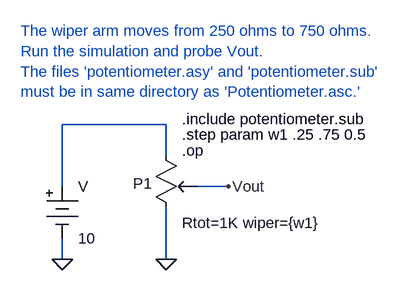
[diagram p0: schematic Potentiometer.asc]
Potentiometer.asc, the LTspice schematic file:
Version 4
SHEET 1 2024 848
WIRE -432 -560 -592 -560
WIRE -432 -512 -432 -560
WIRE -592 -464 -592 -560
WIRE -336 -464 -384 -464
WIRE -592 -352 -592 -384
WIRE -432 -352 -432 -432
FLAG -432 -352 0
FLAG -592 -352 0
FLAG -336 -464 Vout
SYMBOL Misc\\battery -592 -480 R0
WINDOW 123 0 0 Left 0
WINDOW 39 0 0 Left 0
SYMATTR InstName V
SYMATTR Value 10
SYMBOL potentiometer -448 -528 R0
WINDOW 3 40 120 Left 0
WINDOW 0 -35 59 Left 0
SYMATTR Value Rtot=1K wiper={w1}
SYMATTR InstName P1
TEXT -408 -568 Left 0 !.include potentiometer.sub
TEXT -408 -544 Left 0 !.step param w1 .25 .75 0.5
TEXT -408 -520 Left 0 !.op
TEXT -656 -704 Left 0 ;The wiper arm moves from 250 ohms to 750 ohms.\nRun the simulation and probe Vout.\nThe files 'potentiometer.asy' and 'potentiometer.sub'\nmust be in same directory as 'Potentiometer.asc.'

The netlist it stands for:
* Potentiometer.asc
V N001 0 10
XP1 N001 0 Vout potentiometer Rtot=1K wiper={w1}  ; pins A B C
.include potentiometer.sub
.step param w1 .25 .75 0.5
.op
* The wiper arm moves from 250 ohms to 750 ohms.
* Run the simulation and probe Vout.
* The files 'potentiometer.asy' and 'potentiometer.sub'
* must be in same directory as 'Potentiometer.asc.'
.backanno
.end